# EAGLE schematic SP-PC-V3.0 (EAGLE 8.7.0)

## Sheet 1 of 9: R2
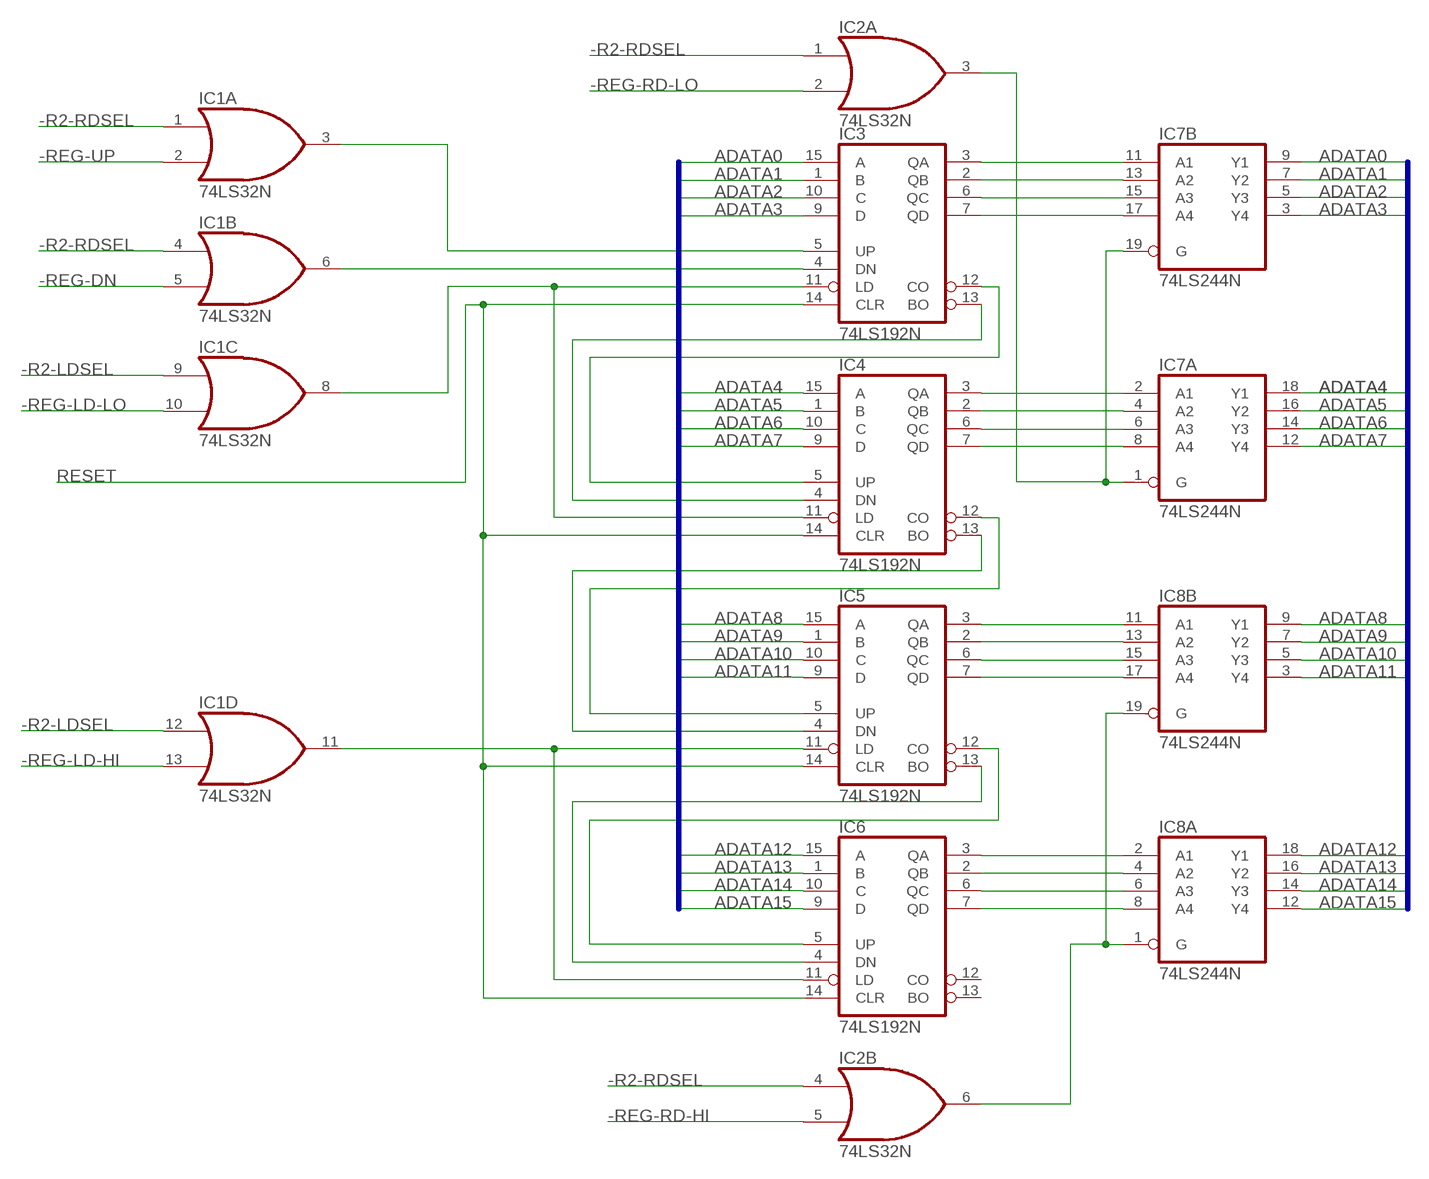
[diagram p0: schematic, sheet 1]

### Parts
IC1  74LS32N  [DIL14]
IC2  74LS32N  [DIL14]
IC3  74LS192N  [DIL16]
IC4  74LS192N  [DIL16]
IC5  74LS192N  [DIL16]
IC6  74LS192N  [DIL16]
IC7  74LS244N  [DIL20]
IC8  74LS244N  [DIL20]

### Nets
-R2-LDSEL: IC1.9(C:I0) IC1.12(D:I0) ; also sheet 7
-R2-RDSEL: IC1.1(A:I0) IC1.4(B:I0) IC2.1(A:I0) IC2.4(B:I0) ; also sheet 7
-REG-DN: IC1.5(B:I1) ; also sheet 2,3,4,9
-REG-LD-HI: IC1.13(D:I1) ; also sheet 2,3,4,9
-REG-LD-LO: IC1.10(C:I1) ; also sheet 2,3,4,9
-REG-RD-HI: IC2.5(B:I1) ; also sheet 2,3,4,9
-REG-RD-LO: IC2.2(A:I1) ; also sheet 2,3,4,9
-REG-UP: IC1.2(A:I1) ; also sheet 2,3,4,9
ADATA0: IC3.15(A) IC7.9(B:Y1) ; also sheet 2,3,4,6,8
ADATA1: IC3.1(B) IC7.7(B:Y2) ; also sheet 2,3,4,6,8
ADATA2: IC3.10(C) IC7.5(B:Y3) ; also sheet 2,3,4,6,8
ADATA3: IC3.9(D) IC7.3(B:Y4) ; also sheet 2,3,4,6,8
ADATA4: IC4.15(A) IC7.18(A:Y1) ; also sheet 2,3,4,6,8
ADATA5: IC4.1(B) IC7.16(A:Y2) ; also sheet 2,3,4,6,8
ADATA6: IC4.10(C) IC7.14(A:Y3) ; also sheet 2,3,4,6,8
ADATA7: IC4.9(D) IC7.12(A:Y4) ; also sheet 2,3,4,6,8
ADATA8: IC5.15(A) IC8.9(B:Y1) ; also sheet 2,3,4,6,8
ADATA9: IC5.1(B) IC8.7(B:Y2) ; also sheet 2,3,4,6,8
ADATA10: IC5.10(C) IC8.5(B:Y3) ; also sheet 2,3,4,6,8
ADATA11: IC5.9(D) IC8.3(B:Y4) ; also sheet 2,3,4,6,8
ADATA12: IC6.15(A) IC8.18(A:Y1) ; also sheet 2,3,4,6,8
ADATA13: IC6.1(B) IC8.16(A:Y2) ; also sheet 2,3,4,6,8
ADATA14: IC6.10(C) IC8.14(A:Y3) ; also sheet 2,3,4,6,8
ADATA15: IC6.9(D) IC8.12(A:Y4) ; also sheet 2,3,4,6,8
N$10: IC3.13(BO) IC4.4(DN)
N$11: IC3.12(CO) IC4.5(UP)
N$12: IC4.13(BO) IC5.4(DN)
N$13: IC4.12(CO) IC5.5(UP)
N$14: IC5.13(BO) IC6.4(DN)
N$15: IC5.12(CO) IC6.5(UP)
N$16: IC1.8(C:O) IC3.11(LD) IC4.11(LD)
N$17: IC1.3(A:O) IC3.5(UP)
N$18: IC1.6(B:O) IC3.4(DN)
N$20: IC2.3(A:O) IC7.1(A:G) IC7.19(B:G)
N$21: IC2.6(B:O) IC8.1(A:G) IC8.19(B:G)
N$22: IC1.11(D:O) IC5.11(LD) IC6.11(LD)
N$115: IC3.3(QA) IC7.11(B:A1)
N$116: IC3.2(QB) IC7.13(B:A2)
N$117: IC3.6(QC) IC7.15(B:A3)
N$118: IC3.7(QD) IC7.17(B:A4)
N$119: IC4.3(QA) IC7.2(A:A1)
N$120: IC4.2(QB) IC7.4(A:A2)
N$121: IC4.6(QC) IC7.6(A:A3)
N$122: IC4.7(QD) IC7.8(A:A4)
N$123: IC5.3(QA) IC8.11(B:A1)
N$124: IC5.2(QB) IC8.13(B:A2)
N$125: IC5.6(QC) IC8.15(B:A3)
N$126: IC5.7(QD) IC8.17(B:A4)
N$127: IC6.3(QA) IC8.2(A:A1)
N$128: IC6.2(QB) IC8.4(A:A2)
N$129: IC6.6(QC) IC8.6(A:A3)
N$130: IC6.7(QD) IC8.8(A:A4)
RESET: IC3.14(CLR) IC4.14(CLR) IC5.14(CLR) IC6.14(CLR) ; also sheet 2,3,4,8
Unconnected: IC6.12(CO) IC6.13(BO)

### Buses
ADATA[0..15]

## Sheet 2 of 9: R0
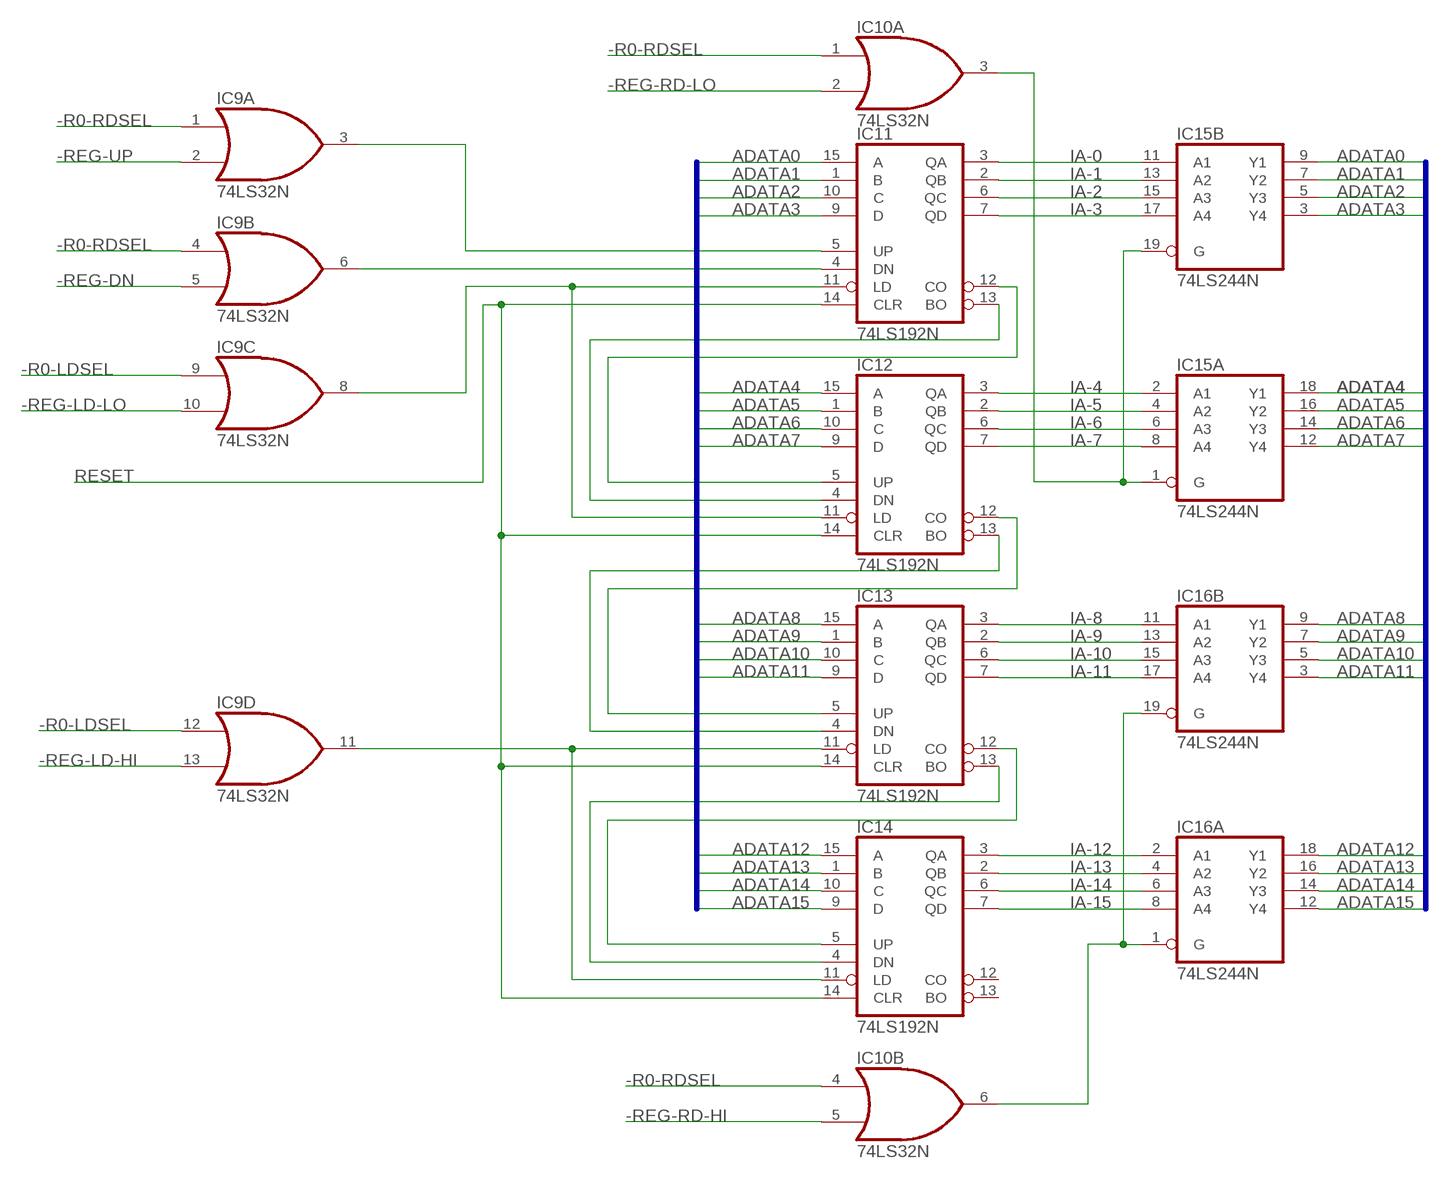
[diagram p1: schematic, sheet 2]

### Parts
IC9  74LS32N  [DIL14]
IC10  74LS32N  [DIL14]
IC11  74LS192N  [DIL16]
IC12  74LS192N  [DIL16]
IC13  74LS192N  [DIL16]
IC14  74LS192N  [DIL16]
IC15  74LS244N  [DIL20]
IC16  74LS244N  [DIL20]

### Nets
-R0-LDSEL: IC9.9(C:I0) IC9.12(D:I0) ; also sheet 7
-R0-RDSEL: IC9.1(A:I0) IC9.4(B:I0) IC10.1(A:I0) IC10.4(B:I0) ; also sheet 7
-REG-DN: IC9.5(B:I1) ; also sheet 1,3,4,9
-REG-LD-HI: IC9.13(D:I1) ; also sheet 1,3,4,9
-REG-LD-LO: IC9.10(C:I1) ; also sheet 1,3,4,9
-REG-RD-HI: IC10.5(B:I1) ; also sheet 1,3,4,9
-REG-RD-LO: IC10.2(A:I1) ; also sheet 1,3,4,9
-REG-UP: IC9.2(A:I1) ; also sheet 1,3,4,9
ADATA0: IC11.15(A) IC15.9(B:Y1) ; also sheet 1,3,4,6,8
ADATA1: IC11.1(B) IC15.7(B:Y2) ; also sheet 1,3,4,6,8
ADATA2: IC11.10(C) IC15.5(B:Y3) ; also sheet 1,3,4,6,8
ADATA3: IC11.9(D) IC15.3(B:Y4) ; also sheet 1,3,4,6,8
ADATA4: IC12.15(A) IC15.18(A:Y1) ; also sheet 1,3,4,6,8
ADATA5: IC12.1(B) IC15.16(A:Y2) ; also sheet 1,3,4,6,8
ADATA6: IC12.10(C) IC15.14(A:Y3) ; also sheet 1,3,4,6,8
ADATA7: IC12.9(D) IC15.12(A:Y4) ; also sheet 1,3,4,6,8
ADATA8: IC13.15(A) IC16.9(B:Y1) ; also sheet 1,3,4,6,8
ADATA9: IC13.1(B) IC16.7(B:Y2) ; also sheet 1,3,4,6,8
ADATA10: IC13.10(C) IC16.5(B:Y3) ; also sheet 1,3,4,6,8
ADATA11: IC13.9(D) IC16.3(B:Y4) ; also sheet 1,3,4,6,8
ADATA12: IC14.15(A) IC16.18(A:Y1) ; also sheet 1,3,4,6,8
ADATA13: IC14.1(B) IC16.16(A:Y2) ; also sheet 1,3,4,6,8
ADATA14: IC14.10(C) IC16.14(A:Y3) ; also sheet 1,3,4,6,8
ADATA15: IC14.9(D) IC16.12(A:Y4) ; also sheet 1,3,4,6,8
IA-0: IC11.3(QA) IC15.11(B:A1) ; also sheet 5
IA-1: IC11.2(QB) IC15.13(B:A2) ; also sheet 5
IA-2: IC11.6(QC) IC15.15(B:A3) ; also sheet 5
IA-3: IC11.7(QD) IC15.17(B:A4) ; also sheet 5
IA-4: IC12.3(QA) IC15.2(A:A1) ; also sheet 5
IA-5: IC12.2(QB) IC15.4(A:A2) ; also sheet 5
IA-6: IC12.6(QC) IC15.6(A:A3) ; also sheet 5
IA-7: IC12.7(QD) IC15.8(A:A4) ; also sheet 5
IA-8: IC13.3(QA) IC16.11(B:A1) ; also sheet 5
IA-9: IC13.2(QB) IC16.13(B:A2) ; also sheet 5
IA-10: IC13.6(QC) IC16.15(B:A3) ; also sheet 5
IA-11: IC13.7(QD) IC16.17(B:A4) ; also sheet 5
IA-12: IC14.3(QA) IC16.2(A:A1) ; also sheet 5
IA-13: IC14.2(QB) IC16.4(A:A2) ; also sheet 5
IA-14: IC14.6(QC) IC16.6(A:A3) ; also sheet 5
IA-15: IC14.7(QD) IC16.8(A:A4) ; also sheet 5
N$28: IC11.13(BO) IC12.4(DN)
N$29: IC11.12(CO) IC12.5(UP)
N$30: IC12.13(BO) IC13.4(DN)
N$31: IC12.12(CO) IC13.5(UP)
N$32: IC13.13(BO) IC14.4(DN)
N$33: IC13.12(CO) IC14.5(UP)
N$34: IC9.8(C:O) IC11.11(LD) IC12.11(LD)
N$35: IC9.3(A:O) IC11.5(UP)
N$36: IC9.6(B:O) IC11.4(DN)
N$38: IC10.3(A:O) IC15.1(A:G) IC15.19(B:G)
N$39: IC10.6(B:O) IC16.1(A:G) IC16.19(B:G)
N$40: IC9.11(D:O) IC13.11(LD) IC14.11(LD)
RESET: IC11.14(CLR) IC12.14(CLR) IC13.14(CLR) IC14.14(CLR) ; also sheet 1,3,4,8
Unconnected: IC14.12(CO) IC14.13(BO)

### Buses
ADATA[0..15]

## Sheet 3 of 9: R3
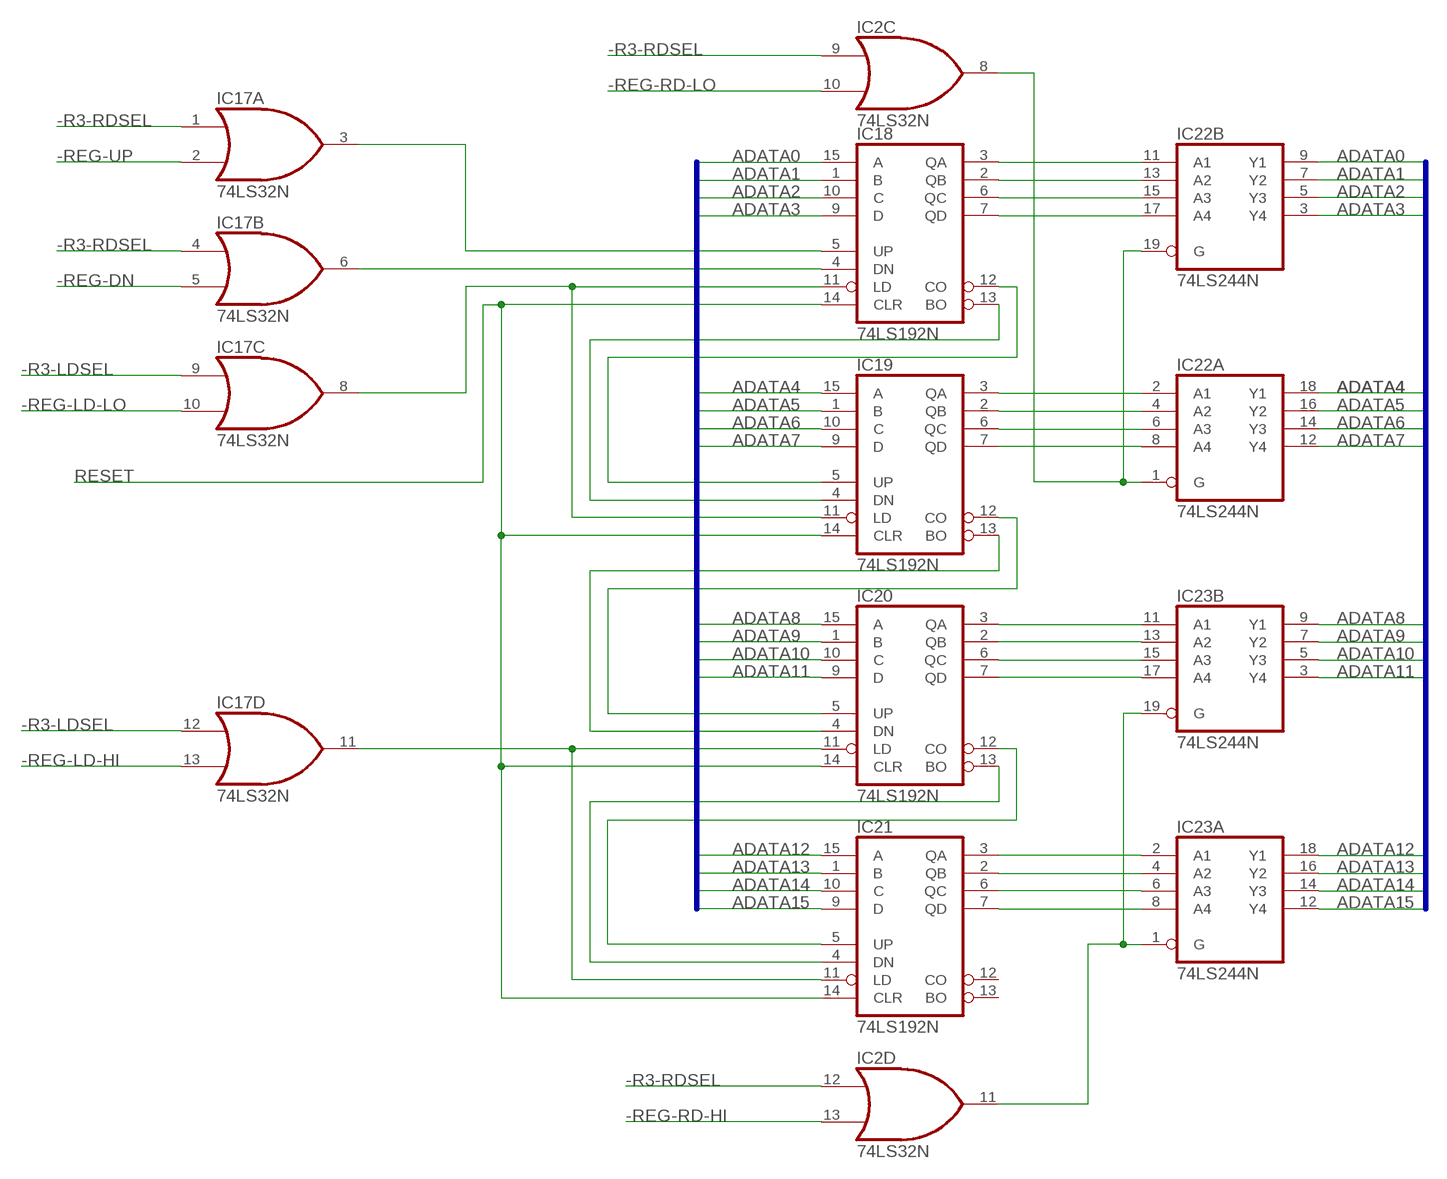
[diagram p2: schematic, sheet 3]

### Parts
IC17  74LS32N  [DIL14]
IC18  74LS192N  [DIL16]
IC19  74LS192N  [DIL16]
IC20  74LS192N  [DIL16]
IC21  74LS192N  [DIL16]
IC22  74LS244N  [DIL20]
IC23  74LS244N  [DIL20]

### Nets
-R3-LDSEL: IC17.9(C:I0) IC17.12(D:I0) ; also sheet 7
-R3-RDSEL: IC2.9(C:I0) IC2.12(D:I0) IC17.1(A:I0) IC17.4(B:I0) ; also sheet 7
-REG-DN: IC17.5(B:I1) ; also sheet 1,2,4,9
-REG-LD-HI: IC17.13(D:I1) ; also sheet 1,2,4,9
-REG-LD-LO: IC17.10(C:I1) ; also sheet 1,2,4,9
-REG-RD-HI: IC2.13(D:I1) ; also sheet 1,2,4,9
-REG-RD-LO: IC2.10(C:I1) ; also sheet 1,2,4,9
-REG-UP: IC17.2(A:I1) ; also sheet 1,2,4,9
ADATA0: IC18.15(A) IC22.9(B:Y1) ; also sheet 1,2,4,6,8
ADATA1: IC18.1(B) IC22.7(B:Y2) ; also sheet 1,2,4,6,8
ADATA2: IC18.10(C) IC22.5(B:Y3) ; also sheet 1,2,4,6,8
ADATA3: IC18.9(D) IC22.3(B:Y4) ; also sheet 1,2,4,6,8
ADATA4: IC19.15(A) IC22.18(A:Y1) ; also sheet 1,2,4,6,8
ADATA5: IC19.1(B) IC22.16(A:Y2) ; also sheet 1,2,4,6,8
ADATA6: IC19.10(C) IC22.14(A:Y3) ; also sheet 1,2,4,6,8
ADATA7: IC19.9(D) IC22.12(A:Y4) ; also sheet 1,2,4,6,8
ADATA8: IC20.15(A) IC23.9(B:Y1) ; also sheet 1,2,4,6,8
ADATA9: IC20.1(B) IC23.7(B:Y2) ; also sheet 1,2,4,6,8
ADATA10: IC20.10(C) IC23.5(B:Y3) ; also sheet 1,2,4,6,8
ADATA11: IC20.9(D) IC23.3(B:Y4) ; also sheet 1,2,4,6,8
ADATA12: IC21.15(A) IC23.18(A:Y1) ; also sheet 1,2,4,6,8
ADATA13: IC21.1(B) IC23.16(A:Y2) ; also sheet 1,2,4,6,8
ADATA14: IC21.10(C) IC23.14(A:Y3) ; also sheet 1,2,4,6,8
ADATA15: IC21.9(D) IC23.12(A:Y4) ; also sheet 1,2,4,6,8
N$58: IC18.13(BO) IC19.4(DN)
N$59: IC18.12(CO) IC19.5(UP)
N$60: IC19.13(BO) IC20.4(DN)
N$61: IC19.12(CO) IC20.5(UP)
N$62: IC20.13(BO) IC21.4(DN)
N$63: IC20.12(CO) IC21.5(UP)
N$64: IC17.8(C:O) IC18.11(LD) IC19.11(LD)
N$65: IC17.3(A:O) IC18.5(UP)
N$66: IC17.6(B:O) IC18.4(DN)
N$80: IC18.3(QA) IC22.11(B:A1)
N$81: IC18.2(QB) IC22.13(B:A2)
N$82: IC18.6(QC) IC22.15(B:A3)
N$83: IC18.7(QD) IC22.17(B:A4)
N$84: IC2.8(C:O) IC22.1(A:G) IC22.19(B:G)
N$85: IC2.11(D:O) IC23.1(A:G) IC23.19(B:G)
N$86: IC17.11(D:O) IC20.11(LD) IC21.11(LD)
N$87: IC19.3(QA) IC22.2(A:A1)
N$88: IC19.2(QB) IC22.4(A:A2)
N$89: IC19.6(QC) IC22.6(A:A3)
N$90: IC19.7(QD) IC22.8(A:A4)
N$91: IC20.3(QA) IC23.11(B:A1)
N$92: IC20.2(QB) IC23.13(B:A2)
N$93: IC20.6(QC) IC23.15(B:A3)
N$94: IC20.7(QD) IC23.17(B:A4)
N$95: IC21.3(QA) IC23.2(A:A1)
N$96: IC21.2(QB) IC23.4(A:A2)
N$97: IC21.6(QC) IC23.6(A:A3)
N$98: IC21.7(QD) IC23.8(A:A4)
RESET: IC18.14(CLR) IC19.14(CLR) IC20.14(CLR) IC21.14(CLR) ; also sheet 1,2,4,8
Unconnected: IC21.12(CO) IC21.13(BO)

### Buses
ADATA[0..15]

## Sheet 4 of 9: R1
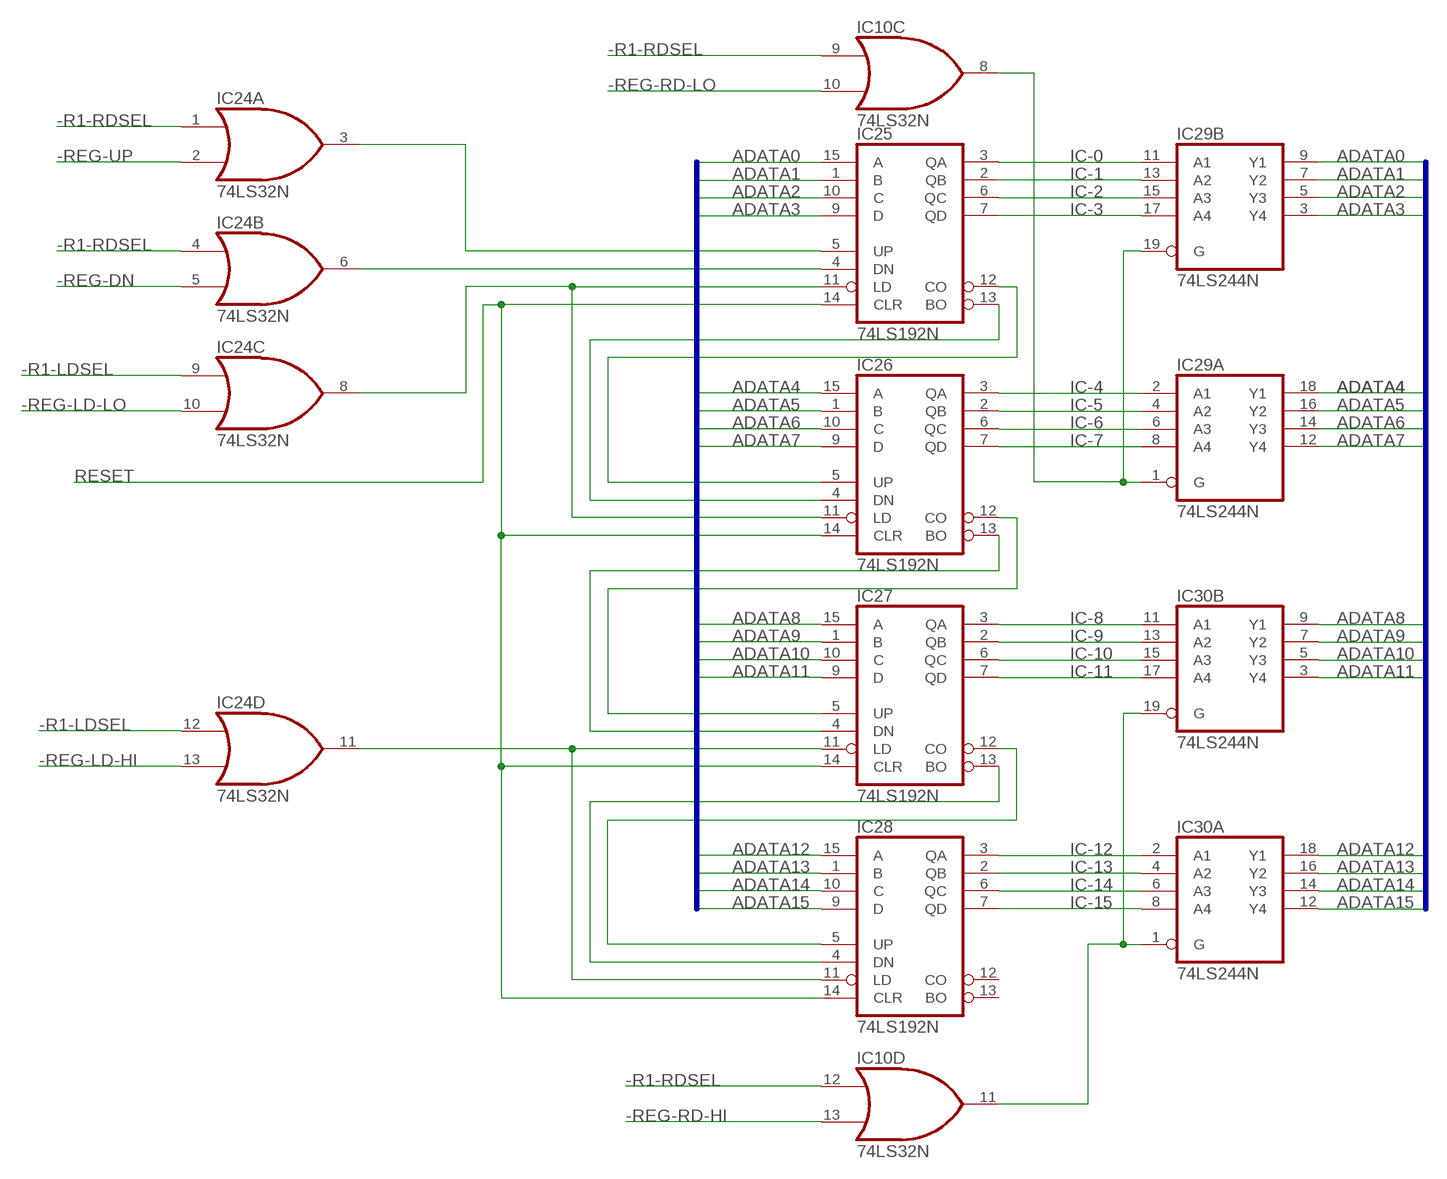
[diagram p3: schematic, sheet 4]

### Parts
IC24  74LS32N  [DIL14]
IC25  74LS192N  [DIL16]
IC26  74LS192N  [DIL16]
IC27  74LS192N  [DIL16]
IC28  74LS192N  [DIL16]
IC29  74LS244N  [DIL20]
IC30  74LS244N  [DIL20]

### Nets
-R1-LDSEL: IC24.9(C:I0) IC24.12(D:I0) ; also sheet 7
-R1-RDSEL: IC10.9(C:I0) IC10.12(D:I0) IC24.1(A:I0) IC24.4(B:I0) ; also sheet 7
-REG-DN: IC24.5(B:I1) ; also sheet 1,2,3,9
-REG-LD-HI: IC24.13(D:I1) ; also sheet 1,2,3,9
-REG-LD-LO: IC24.10(C:I1) ; also sheet 1,2,3,9
-REG-RD-HI: IC10.13(D:I1) ; also sheet 1,2,3,9
-REG-RD-LO: IC10.10(C:I1) ; also sheet 1,2,3,9
-REG-UP: IC24.2(A:I1) ; also sheet 1,2,3,9
ADATA0: IC25.15(A) IC29.9(B:Y1) ; also sheet 1,2,3,6,8
ADATA1: IC25.1(B) IC29.7(B:Y2) ; also sheet 1,2,3,6,8
ADATA2: IC25.10(C) IC29.5(B:Y3) ; also sheet 1,2,3,6,8
ADATA3: IC25.9(D) IC29.3(B:Y4) ; also sheet 1,2,3,6,8
ADATA4: IC26.15(A) IC29.18(A:Y1) ; also sheet 1,2,3,6,8
ADATA5: IC26.1(B) IC29.16(A:Y2) ; also sheet 1,2,3,6,8
ADATA6: IC26.10(C) IC29.14(A:Y3) ; also sheet 1,2,3,6,8
ADATA7: IC26.9(D) IC29.12(A:Y4) ; also sheet 1,2,3,6,8
ADATA8: IC27.15(A) IC30.9(B:Y1) ; also sheet 1,2,3,6,8
ADATA9: IC27.1(B) IC30.7(B:Y2) ; also sheet 1,2,3,6,8
ADATA10: IC27.10(C) IC30.5(B:Y3) ; also sheet 1,2,3,6,8
ADATA11: IC27.9(D) IC30.3(B:Y4) ; also sheet 1,2,3,6,8
ADATA12: IC28.15(A) IC30.18(A:Y1) ; also sheet 1,2,3,6,8
ADATA13: IC28.1(B) IC30.16(A:Y2) ; also sheet 1,2,3,6,8
ADATA14: IC28.10(C) IC30.14(A:Y3) ; also sheet 1,2,3,6,8
ADATA15: IC28.9(D) IC30.12(A:Y4) ; also sheet 1,2,3,6,8
IC-0: IC25.3(QA) IC29.11(B:A1) ; also sheet 5
IC-1: IC25.2(QB) IC29.13(B:A2) ; also sheet 5
IC-2: IC25.6(QC) IC29.15(B:A3) ; also sheet 5
IC-3: IC25.7(QD) IC29.17(B:A4) ; also sheet 5
IC-4: IC26.3(QA) IC29.2(A:A1) ; also sheet 5
IC-5: IC26.2(QB) IC29.4(A:A2) ; also sheet 5
IC-6: IC26.6(QC) IC29.6(A:A3) ; also sheet 5
IC-7: IC26.7(QD) IC29.8(A:A4) ; also sheet 5
IC-8: IC27.3(QA) IC30.11(B:A1) ; also sheet 5
IC-9: IC27.2(QB) IC30.13(B:A2) ; also sheet 5
IC-10: IC27.6(QC) IC30.15(B:A3) ; also sheet 5
IC-11: IC27.7(QD) IC30.17(B:A4) ; also sheet 5
IC-12: IC28.3(QA) IC30.2(A:A1)
IC-13: IC28.2(QB) IC30.4(A:A2) ; also sheet 5
IC-14: IC28.6(QC) IC30.6(A:A3) ; also sheet 5
IC-15: IC28.7(QD) IC30.8(A:A4) ; also sheet 5
N$2: IC25.13(BO) IC26.4(DN)
N$3: IC25.12(CO) IC26.5(UP)
N$4: IC26.13(BO) IC27.4(DN)
N$5: IC26.12(CO) IC27.5(UP)
N$6: IC27.13(BO) IC28.4(DN)
N$7: IC27.12(CO) IC28.5(UP)
N$8: IC24.8(C:O) IC25.11(LD) IC26.11(LD)
N$9: IC24.3(A:O) IC25.5(UP)
N$23: IC24.6(B:O) IC25.4(DN)
N$25: IC10.8(C:O) IC29.1(A:G) IC29.19(B:G)
N$26: IC10.11(D:O) IC30.1(A:G) IC30.19(B:G)
N$27: IC24.11(D:O) IC27.11(LD) IC28.11(LD)
RESET: IC25.14(CLR) IC26.14(CLR) IC27.14(CLR) IC28.14(CLR) ; also sheet 1,2,3,8
Unconnected: IC28.12(CO) IC28.13(BO)

### Buses
ADATA[0..15]

## Sheet 5 of 9: Front Panel
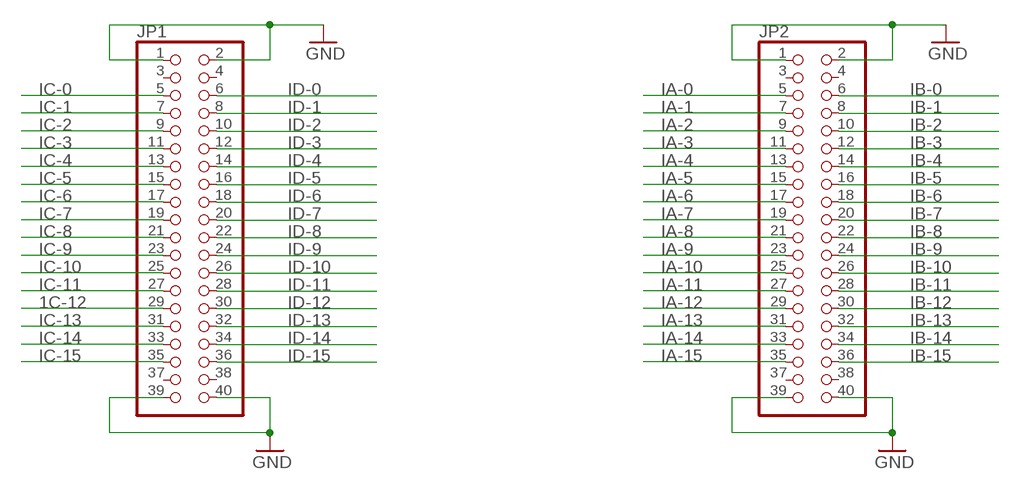
[diagram p4: schematic, sheet 5]

### Parts
JP1  PINHD-2X20  [2X20]
JP2  PINHD-2X20  [2X20]

### Nets
1C-12: JP1.29
GND: JP1.1 JP1.2 JP1.39 JP1.40 JP2.1 JP2.2 JP2.39 JP2.40 ; also sheet 6,8,9
IA-0: JP2.5 ; also sheet 2
IA-1: JP2.7 ; also sheet 2
IA-2: JP2.9 ; also sheet 2
IA-3: JP2.11 ; also sheet 2
IA-4: JP2.13 ; also sheet 2
IA-5: JP2.15 ; also sheet 2
IA-6: JP2.17 ; also sheet 2
IA-7: JP2.19 ; also sheet 2
IA-8: JP2.21 ; also sheet 2
IA-9: JP2.23 ; also sheet 2
IA-10: JP2.25 ; also sheet 2
IA-11: JP2.27 ; also sheet 2
IA-12: JP2.29 ; also sheet 2
IA-13: JP2.31 ; also sheet 2
IA-14: JP2.33 ; also sheet 2
IA-15: JP2.35 ; also sheet 2
IB-0: JP2.6
IB-1: JP2.8
IB-2: JP2.10
IB-3: JP2.12
IB-4: JP2.14
IB-5: JP2.16
IB-6: JP2.18
IB-7: JP2.20
IB-8: JP2.22
IB-9: JP2.24
IB-10: JP2.26
IB-11: JP2.28
IB-12: JP2.30
IB-13: JP2.32
IB-14: JP2.34
IB-15: JP2.36
IC-0: JP1.5 ; also sheet 4
IC-1: JP1.7 ; also sheet 4
IC-2: JP1.9 ; also sheet 4
IC-3: JP1.11 ; also sheet 4
IC-4: JP1.13 ; also sheet 4
IC-5: JP1.15 ; also sheet 4
IC-6: JP1.17 ; also sheet 4
IC-7: JP1.19 ; also sheet 4
IC-8: JP1.21 ; also sheet 4
IC-9: JP1.23 ; also sheet 4
IC-10: JP1.25 ; also sheet 4
IC-11: JP1.27 ; also sheet 4
IC-13: JP1.31 ; also sheet 4
IC-14: JP1.33 ; also sheet 4
IC-15: JP1.35 ; also sheet 4
ID-0: JP1.6
ID-1: JP1.8
ID-2: JP1.10
ID-3: JP1.12
ID-4: JP1.14
ID-5: JP1.16
ID-6: JP1.18
ID-7: JP1.20
ID-8: JP1.22
ID-9: JP1.24
ID-10: JP1.26
ID-11: JP1.28
ID-12: JP1.30
ID-13: JP1.32
ID-14: JP1.34
ID-15: JP1.36
Unconnected: JP1.3 JP1.4 JP1.37 JP1.38 JP2.3 JP2.4 JP2.37 JP2.38

## Sheet 6 of 9: PULLUPS & BYPASS & UNUSED
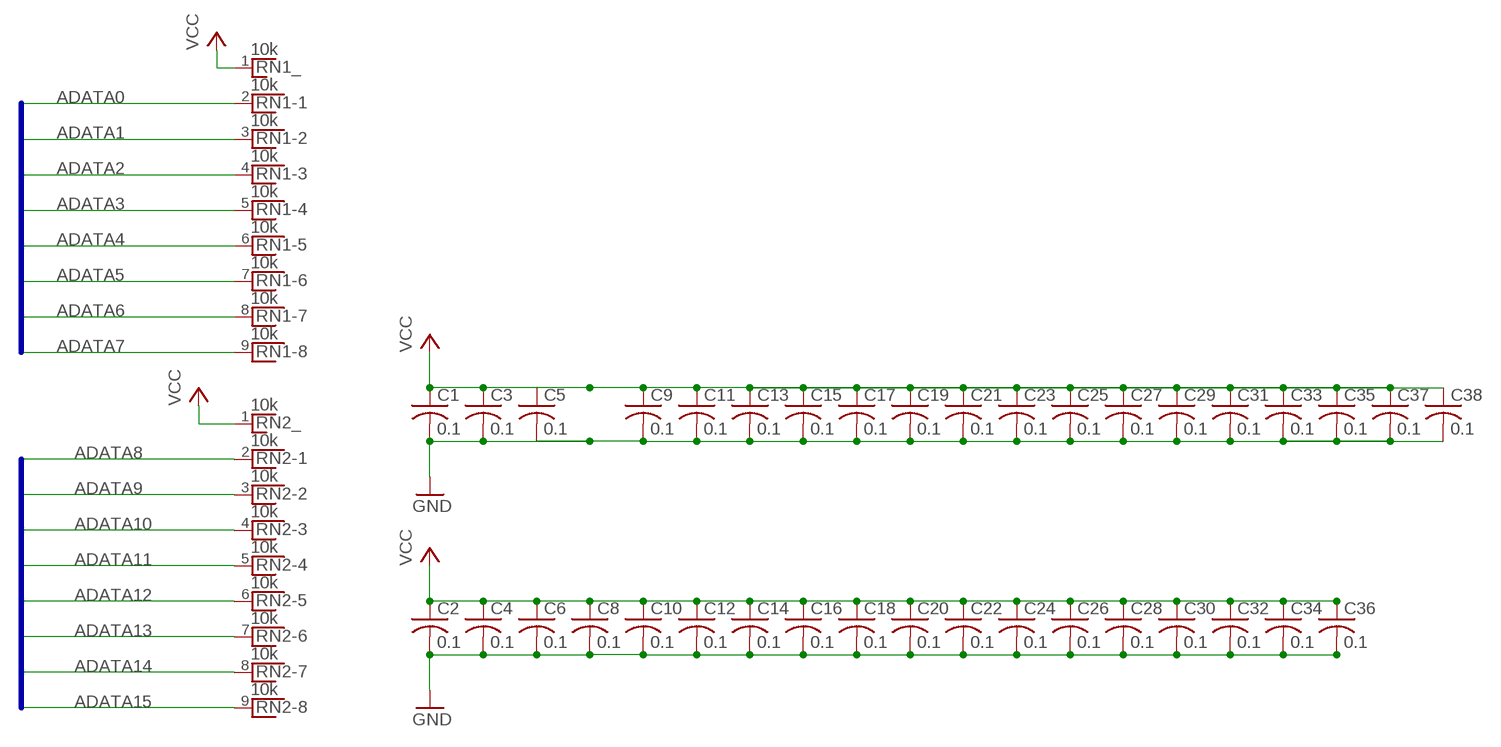
[diagram p5: schematic, sheet 6]

### Parts
C1  0.1  C-US025-040X050  [C025-040X050]
C2  0.1  C-US025-040X050  [C025-040X050]
C3  0.1  C-US025-040X050  [C025-040X050]
C4  0.1  C-US025-040X050  [C025-040X050]
C5  0.1  C-US025-040X050  [C025-040X050]
C6  0.1  C-US025-040X050  [C025-040X050]
C8  0.1  C-US025-040X050  [C025-040X050]
C9  0.1  C-US025-040X050  [C025-040X050]
C10  0.1  C-US025-040X050  [C025-040X050]
C11  0.1  C-US025-040X050  [C025-040X050]
C12  0.1  C-US025-040X050  [C025-040X050]
C13  0.1  C-US025-040X050  [C025-040X050]
C14  0.1  C-US025-040X050  [C025-040X050]
C15  0.1  C-US025-040X050  [C025-040X050]
C16  0.1  C-US025-040X050  [C025-040X050]
C17  0.1  C-US025-040X050  [C025-040X050]
C18  0.1  C-US025-040X050  [C025-040X050]
C19  0.1  C-US025-040X050  [C025-040X050]
C20  0.1  C-US025-040X050  [C025-040X050]
C21  0.1  C-US025-040X050  [C025-040X050]
C22  0.1  C-US025-040X050  [C025-040X050]
C23  0.1  C-US025-040X050  [C025-040X050]
C24  0.1  C-US025-040X050  [C025-040X050]
C25  0.1  C-US025-040X050  [C025-040X050]
C26  0.1  C-US025-040X050  [C025-040X050]
C27  0.1  C-US025-040X050  [C025-040X050]
C28  0.1  C-US025-040X050  [C025-040X050]
C29  0.1  C-US025-040X050  [C025-040X050]
C30  0.1  C-US025-040X050  [C025-040X050]
C31  0.1  C-US025-040X050  [C025-040X050]
C32  0.1  C-US025-040X050  [C025-040X050]
C33  0.1  C-US025-040X050  [C025-040X050]
C34  0.1  C-US025-040X050  [C025-040X050]
C35  0.1  C-US025-040X050  [C025-040X050]
C36  0.1  C-US025-040X050  [C025-040X050]
C37  0.1  C-US025-040X050  [C025-040X050]
C38  0.1  C-US025-040X050  [C025-040X050]
RN1  10k  RNX8  [RN-9]
RN2  10k  RNX8  [RN-9]

### Nets
ADATA0: RN1.2 ; also sheet 1,2,3,4,8
ADATA1: RN1.3 ; also sheet 1,2,3,4,8
ADATA2: RN1.4 ; also sheet 1,2,3,4,8
ADATA3: RN1.5 ; also sheet 1,2,3,4,8
ADATA4: RN1.6 ; also sheet 1,2,3,4,8
ADATA5: RN1.7 ; also sheet 1,2,3,4,8
ADATA6: RN1.8 ; also sheet 1,2,3,4,8
ADATA7: RN1.9 ; also sheet 1,2,3,4,8
ADATA8: RN2.2 ; also sheet 1,2,3,4,8
ADATA9: RN2.3 ; also sheet 1,2,3,4,8
ADATA10: RN2.4 ; also sheet 1,2,3,4,8
ADATA11: RN2.5 ; also sheet 1,2,3,4,8
ADATA12: RN2.6 ; also sheet 1,2,3,4,8
ADATA13: RN2.7 ; also sheet 1,2,3,4,8
ADATA14: RN2.8 ; also sheet 1,2,3,4,8
ADATA15: RN2.9 ; also sheet 1,2,3,4,8
GND: C1.2 C2.2 C3.2 C4.2 C5.2 C6.2 C8.2 C9.2 C10.2 C11.2 C12.2 C13.2 C14.2 C15.2 C16.2 C17.2 C18.2 C19.2 C20.2 C21.2 C22.2 C23.2 C24.2 C25.2 C26.2 C27.2 C28.2 C29.2 C30.2 C31.2 C32.2 C33.2 C34.2 C35.2 C36.2 C37.2 C38.2 ; also sheet 5,8,9
VCC: C1.1 C2.1 C3.1 C4.1 C5.1 C6.1 C8.1 C9.1 C10.1 C11.1 C12.1 C13.1 C14.1 C15.1 C16.1 C17.1 C18.1 C19.1 C20.1 C21.1 C22.1 C23.1 C24.1 C25.1 C26.1 C27.1 C28.1 C29.1 C30.1 C31.1 C32.1 C33.1 C34.1 C35.1 C36.1 C37.1 C38.1 RN1.1 RN2.1 ; also sheet 9

### Buses
ADATA[0..7]
ADATA[8..15]

## Sheet 7 of 9: Select Logic
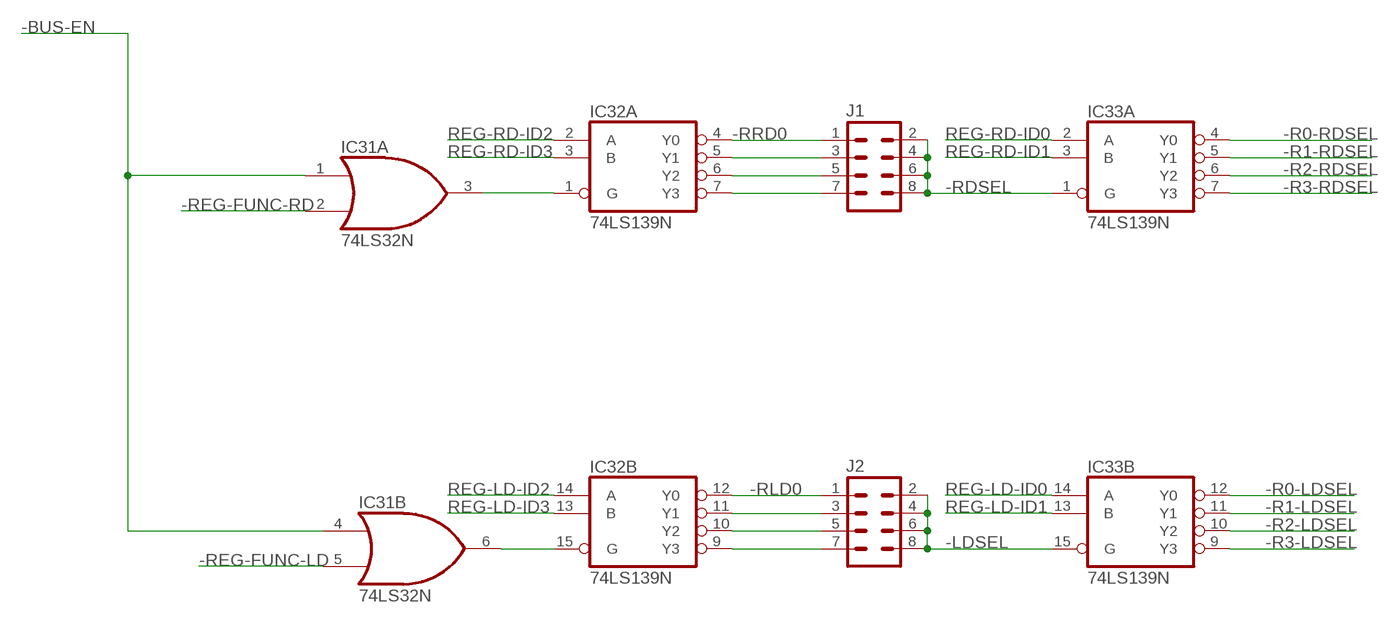
[diagram p6: schematic, sheet 7]

### Parts
IC31  74LS32N  [DIL14]
IC32  74LS139N  [DIL16]
IC33  74LS139N  [DIL16]
J1  M04X2  [2X4]
J2  M04X2  [2X4]

### Nets
-BUS-EN: IC31.1(A:I0) IC31.4(B:I0) ; also sheet 9
-LDSEL: IC33.15(B:G) J2.2 J2.4 J2.6 J2.8 ; also sheet 8
-R0-LDSEL: IC33.12(B:Y0) ; also sheet 2
-R0-RDSEL: IC33.4(A:Y0) ; also sheet 2
-R1-LDSEL: IC33.11(B:Y1) ; also sheet 4
-R1-RDSEL: IC33.5(A:Y1) ; also sheet 4
-R2-LDSEL: IC33.10(B:Y2) ; also sheet 1
-R2-RDSEL: IC33.6(A:Y2) ; also sheet 1
-R3-LDSEL: IC33.9(B:Y3) ; also sheet 3
-R3-RDSEL: IC33.7(A:Y3) ; also sheet 3
-RDSEL: IC33.1(A:G) J1.2 J1.4 J1.6 J1.8 ; also sheet 8
-REG-FUNC-LD: IC31.5(B:I1) ; also sheet 9
-REG-FUNC-RD: IC31.2(A:I1) ; also sheet 9
-RLD0: IC32.12(B:Y0) J2.1
-RRD0: IC32.4(A:Y0) J1.1
N$19: IC31.3(A:O) IC32.1(A:G)
N$24: IC31.6(B:O) IC32.15(B:G)
N$43: IC32.5(A:Y1) J1.3
N$46: IC32.6(A:Y2) J1.5
N$47: IC32.7(A:Y3) J1.7
N$48: IC32.11(B:Y1) J2.3
N$49: IC32.10(B:Y2) J2.5
N$50: IC32.9(B:Y3) J2.7
REG-LD-ID0: IC33.14(B:A) ; also sheet 9
REG-LD-ID1: IC33.13(B:B) ; also sheet 9
REG-LD-ID2: IC32.14(B:A) ; also sheet 9
REG-LD-ID3: IC32.13(B:B) ; also sheet 9
REG-RD-ID0: IC33.2(A:A) ; also sheet 9
REG-RD-ID1: IC33.3(A:B) ; also sheet 9
REG-RD-ID2: IC32.2(A:A) ; also sheet 9
REG-RD-ID3: IC32.3(A:B) ; also sheet 9

## Sheet 8 of 9: bus buffering
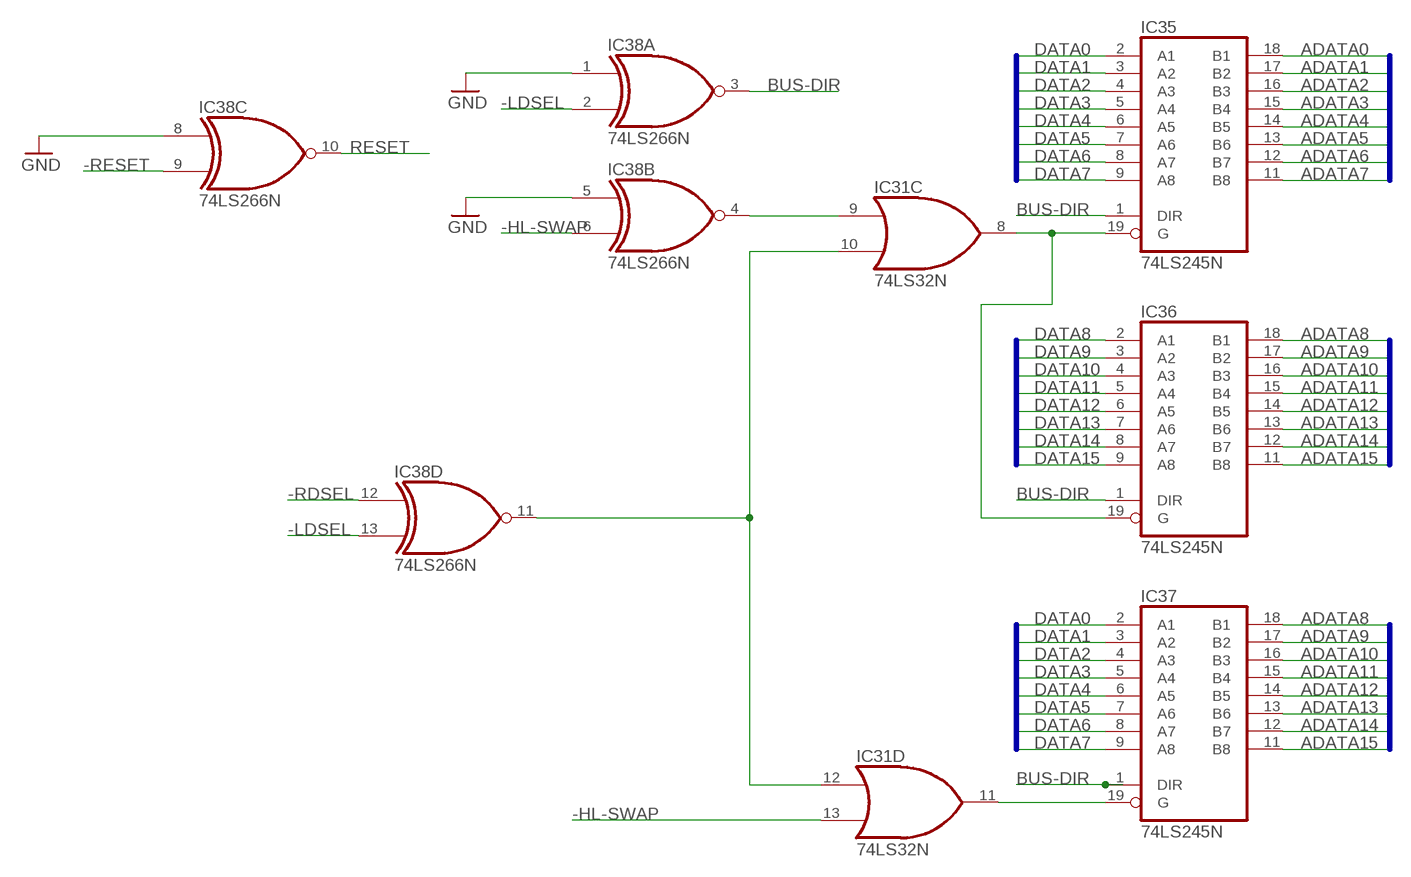
[diagram p7: schematic, sheet 8]

### Parts
IC35  74LS245N  [DIL20]
IC36  74LS245N  [DIL20]
IC37  74LS245N  [DIL20]
IC38  74LS266N  [DIL14]

### Nets
-HL-SWAP: IC31.13(D:I1) IC38.6(B:I1) ; also sheet 9
-LDSEL: IC38.2(A:I1) IC38.13(D:I1) ; also sheet 7
-RDSEL: IC38.12(D:I0) ; also sheet 7
-RESET: IC38.9(C:I1) ; also sheet 9
ADATA0: IC35.18(B1) ; also sheet 1,2,3,4,6
ADATA1: IC35.17(B2) ; also sheet 1,2,3,4,6
ADATA2: IC35.16(B3) ; also sheet 1,2,3,4,6
ADATA3: IC35.15(B4) ; also sheet 1,2,3,4,6
ADATA4: IC35.14(B5) ; also sheet 1,2,3,4,6
ADATA5: IC35.13(B6) ; also sheet 1,2,3,4,6
ADATA6: IC35.12(B7) ; also sheet 1,2,3,4,6
ADATA7: IC35.11(B8) ; also sheet 1,2,3,4,6
ADATA8: IC36.18(B1) IC37.18(B1) ; also sheet 1,2,3,4,6
ADATA9: IC36.17(B2) IC37.17(B2) ; also sheet 1,2,3,4,6
ADATA10: IC36.16(B3) IC37.16(B3) ; also sheet 1,2,3,4,6
ADATA11: IC36.15(B4) IC37.15(B4) ; also sheet 1,2,3,4,6
ADATA12: IC36.14(B5) IC37.14(B5) ; also sheet 1,2,3,4,6
ADATA13: IC36.13(B6) IC37.13(B6) ; also sheet 1,2,3,4,6
ADATA14: IC36.12(B7) IC37.12(B7) ; also sheet 1,2,3,4,6
ADATA15: IC36.11(B8) IC37.11(B8) ; also sheet 1,2,3,4,6
BUS-DIR: IC35.1(DIR) IC36.1(DIR) IC37.1(DIR) IC38.3(A:O)
DATA0: IC35.2(A1) IC37.2(A1) ; also sheet 9
DATA1: IC35.3(A2) IC37.3(A2) ; also sheet 9
DATA2: IC35.4(A3) IC37.4(A3) ; also sheet 9
DATA3: IC35.5(A4) IC37.5(A4) ; also sheet 9
DATA4: IC35.6(A5) IC37.6(A5) ; also sheet 9
DATA5: IC35.7(A6) IC37.7(A6) ; also sheet 9
DATA6: IC35.8(A7) IC37.8(A7) ; also sheet 9
DATA7: IC35.9(A8) IC37.9(A8) ; also sheet 9
DATA8: IC36.2(A1) ; also sheet 9
DATA9: IC36.3(A2) ; also sheet 9
DATA10: IC36.4(A3) ; also sheet 9
DATA11: IC36.5(A4) ; also sheet 9
DATA12: IC36.6(A5) ; also sheet 9
DATA13: IC36.7(A6) ; also sheet 9
DATA14: IC36.8(A7) ; also sheet 9
DATA15: IC36.9(A8) ; also sheet 9
GND: IC38.1(A:I0) IC38.5(B:I0) IC38.8(C:I0) ; also sheet 5,6,9
N$1: IC31.8(C:O) IC35.19(G) IC36.19(G)
N$37: IC31.11(D:O) IC37.19(G)
N$41: IC31.9(C:I0) IC38.4(B:O)
N$42: IC31.10(C:I1) IC31.12(D:I0) IC38.11(D:O)
RESET: IC38.10(C:O) ; also sheet 1,2,3,4

### Buses
DATA[8..15]
DATA[0..7]
ADATA[0..7]
ADATA[8..15]

## Sheet 9 of 9: BUS
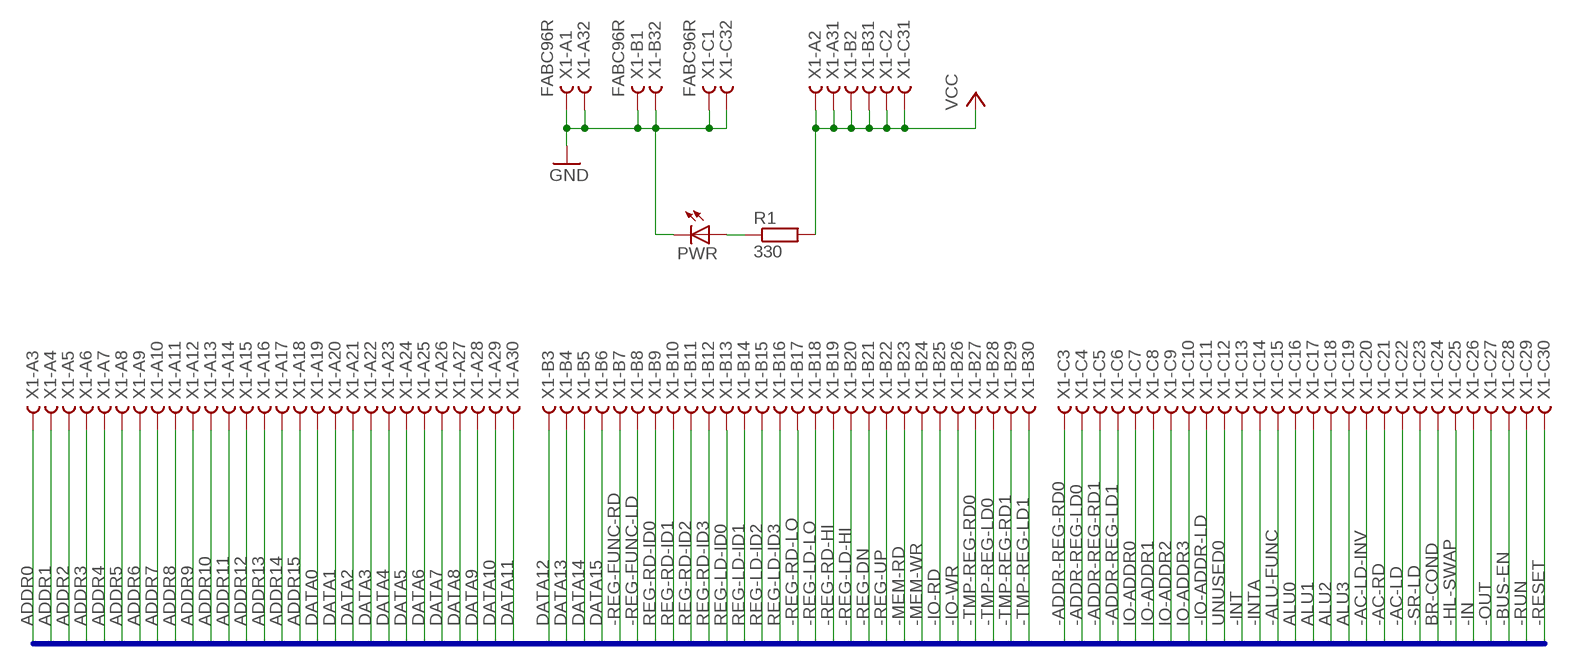
[diagram p8: schematic, sheet 9]

### Parts
PWR  LED5MM  [LED5MM]
R1  330  R0207/10  [0207/10]
X1  FABC96R  [FABC96R]

### Nets
-AC-LD: X1.C22
-AC-LD-INV: X1.C20
-AC-RD: X1.C21
-ADDR-REG-LD0: X1.C4
-ADDR-REG-LD1: X1.C6
-ADDR-REG-RD0: X1.C3
-ADDR-REG-RD1: X1.C5
-ALU-FUNC: X1.C15
-BUS-EN: X1.C28 ; also sheet 7
-HL-SWAP: X1.C25 ; also sheet 8
-IN: X1.C26
-INT: X1.C13
-INTA: X1.C14
-IO-ADDR-LD: X1.C11
-IO-RD: X1.B25
-IO-WR: X1.B26
-MEM-RD: X1.B23
-MEM-WR: X1.B24
-OUT: X1.C27
-REG-DN: X1.B21 ; also sheet 1,2,3,4
-REG-FUNC-LD: X1.B8 ; also sheet 7
-REG-FUNC-RD: X1.B7 ; also sheet 7
-REG-LD-HI: X1.B20 ; also sheet 1,2,3,4
-REG-LD-LO: X1.B18 ; also sheet 1,2,3,4
-REG-RD-HI: X1.B19 ; also sheet 1,2,3,4
-REG-RD-LO: X1.B17 ; also sheet 1,2,3,4
-REG-UP: X1.B22 ; also sheet 1,2,3,4
-RESET: X1.C30 ; also sheet 8
-RUN: X1.C29
-SR-LD: X1.C23
-TMP-REG-LD0: X1.B28
-TMP-REG-LD1: X1.B30
-TMP-REG-RD0: X1.B27
-TMP-REG-RD1: X1.B29
ADDR0: X1.A3
ADDR1: X1.A4
ADDR2: X1.A5
ADDR3: X1.A6
ADDR4: X1.A7
ADDR5: X1.A8
ADDR6: X1.A9
ADDR7: X1.A10
ADDR8: X1.A11
ADDR9: X1.A12
ADDR10: X1.A13
ADDR11: X1.A14
ADDR12: X1.A15
ADDR13: X1.A16
ADDR14: X1.A17
ADDR15: X1.A18
ALU0: X1.C16
ALU1: X1.C17
ALU2: X1.C18
ALU3: X1.C19
BR-COND: X1.C24
DATA0: X1.A19 ; also sheet 8
DATA1: X1.A20 ; also sheet 8
DATA2: X1.A21 ; also sheet 8
DATA3: X1.A22 ; also sheet 8
DATA4: X1.A23 ; also sheet 8
DATA5: X1.A24 ; also sheet 8
DATA6: X1.A25 ; also sheet 8
DATA7: X1.A26 ; also sheet 8
DATA8: X1.A27 ; also sheet 8
DATA9: X1.A28 ; also sheet 8
DATA10: X1.A29 ; also sheet 8
DATA11: X1.A30 ; also sheet 8
DATA12: X1.B3 ; also sheet 8
DATA13: X1.B4 ; also sheet 8
DATA14: X1.B5 ; also sheet 8
DATA15: X1.B6 ; also sheet 8
GND: PWR.K(C) X1.A1 X1.A32 X1.B1 X1.B32 X1.C1 X1.C32 ; also sheet 5,6,8
IO-ADDR0: X1.C7
IO-ADDR1: X1.C8
IO-ADDR2: X1.C9
IO-ADDR3: X1.C10
N$44: PWR.A R1.1
REG-LD-ID0: X1.B13 ; also sheet 7
REG-LD-ID1: X1.B14 ; also sheet 7
REG-LD-ID2: X1.B15 ; also sheet 7
REG-LD-ID3: X1.B16 ; also sheet 7
REG-RD-ID0: X1.B9 ; also sheet 7
REG-RD-ID1: X1.B10 ; also sheet 7
REG-RD-ID2: X1.B11 ; also sheet 7
REG-RD-ID3: X1.B12 ; also sheet 7
UNUSED0: X1.C12
VCC: R1.2 X1.A2 X1.A31 X1.B2 X1.B31 X1.C2 X1.C31 ; also sheet 6

### Buses
ADDR[0..15],DATA[0..15],-REG-FUNC-RD,-REG-FUNC-LD,REG-RD-ID[0..3],REG-LD-ID[0..3],-REG-RD-LO,-REG-LD-LO,-REG-RD-HI,-REG-LD-HI,-REG-DN,-REG-UP,-MEM-RD,-MEM-WR,-IO-RD,-IO-WR,-TMP-REG-RD[0..1],-TMP-REG-LD[0..1],-ADDR-REG-RD[0..1],-ADDR-REG-LD[0..1],IO-ADDR[0..3],-IO-ADDR-LD,UNUSED0,-INT,-INTA,-ALU-FUNC,ALU[0..3],-AC-LD-INV,-AC-LD,-AC-RD,-SR-LD,BR-COND,-HL-SWAP,-IN,-OUT,-BUS-EN,-RESET,-RUN

## Power pins joined to a net without a drawn wire
GND: IC1.7(P:GND) IC2.7(P:GND) IC3.8(GND) IC4.8(GND) IC5.8(GND) IC6.8(GND) IC7.10(P:GND) IC8.10(P:GND) IC9.7(P:GND) IC10.7(P:GND) IC11.8(GND) IC12.8(GND) IC13.8(GND) IC14.8(GND) IC15.10(P:GND) IC16.10(P:GND) IC17.7(P:GND) IC18.8(GND) IC19.8(GND) IC20.8(GND) IC21.8(GND) IC22.10(P:GND) IC23.10(P:GND) IC24.7(P:GND) IC25.8(GND) IC26.8(GND) IC27.8(GND) IC28.8(GND) IC29.10(P:GND) IC30.10(P:GND) IC31.7(P:GND) IC32.8(P:GND) IC33.8(P:GND) IC35.10(GND) IC36.10(GND) IC37.10(GND) IC38.7(P:GND)
VCC: IC1.14(P:VCC) IC2.14(P:VCC) IC3.16(VCC) IC4.16(VCC) IC5.16(VCC) IC6.16(VCC) IC7.20(P:VCC) IC8.20(P:VCC) IC9.14(P:VCC) IC10.14(P:VCC) IC11.16(VCC) IC12.16(VCC) IC13.16(VCC) IC14.16(VCC) IC15.20(P:VCC) IC16.20(P:VCC) IC17.14(P:VCC) IC18.16(VCC) IC19.16(VCC) IC20.16(VCC) IC21.16(VCC) IC22.20(P:VCC) IC23.20(P:VCC) IC24.14(P:VCC) IC25.16(VCC) IC26.16(VCC) IC27.16(VCC) IC28.16(VCC) IC29.20(P:VCC) IC30.20(P:VCC) IC31.14(P:VCC) IC32.16(P:VCC) IC33.16(P:VCC) IC35.20(VCC) IC36.20(VCC) IC37.20(VCC) IC38.14(P:VCC)

## Library data of the parts
C1-C6 C8-C38 = resistor:C-US: CAPACITOR, American symbol
IC1 IC2 IC9 IC10 IC17 IC24 IC31 = 74xx-us:74*32: Quad 2-input OR gate
IC3-IC6 IC11-IC14 IC18-IC21 IC25-IC28 = 74xx-us:74*192: Synchronous 4-bit UP/DOWN COUNTER
IC7 IC8 IC15 IC16 IC22 IC23 IC29 IC30 = 74xx-us:74*244: Octal BUFFER and LINE DRIVER, 3-state
IC32 IC33 = 74xx-us:74*139: Dual 2-line to 4-line DECODER/DEMULTIPLEXER
IC35-IC37 = 74xx-us:74*245: Octal BUS TRANSCEIVER, 3-state
IC38 = 74xx-us:74*266: Quadruple EXCLUSIVE-NOR (XNOR), open-collector
J1 J2 = SparkFun-Connectors:M04X2: .1" header, two rows of four.
JP1 JP2 = pinhead:PINHD-2X20: PIN HEADER
PWR = led:LED: LED OSRAM: - CHIPLED LG R971, LG N971, LY N971, LG Q971, LY Q971, LO R971, LY R971 LH N974, LH R974 LS Q976, LO Q976, LY Q976 LO Q996 - Hyper CHIPLED LW Q18S LB Q993, LB Q99A, LB R99A - SideLED LS A670, LO A670, LY A670, LG A670, LP A670 LB A673, LV A673, LT A673, LW A673 LH A674 LY A675 LS A676, LA A676, LO A676, LY A676, LW A676 LS A679, LY A679, LG A679 - Hyper Micro SIDELED® LS Y876, LA Y876, LO Y876, LY Y876 LT Y87S - SmartLED LW L88C, LW L88S LB L89C, LB L89S, LG L890 LS L89K, LO L89K, LY L89K LS L896, LA L896, LO L896, LY L896 - TOPLED LS T670, LO T670, LY T670, LG T670, LP T670 LSG T670, LSP T670, LSY T670, LOP T670, LYG T670 LG T671, LOG T671, LSG T671 LB T673, LV T673, LT T673, LW T673 LH T674 LS T676, LA T676, LO T676, LY T676, LB T676, LH T676, LSB T676, LW T676 LB T67C, LV T67C, LT T67C, LS T67K, LO T67K, LY T67K, LW E67C LS E67B, LA E67B, LO E67B, LY E67B, LB E67C, LV E67C, LT E67C LW T67C LS T679, LY T679, LG T679 LS T770, LO T770, LY T770, LG T770, LP T770 LB T773, LV T773, LT T773, LW T773 LH T774 LS E675, LA E675, LY E675, LS T675 LS T776, LA T776, LO T776, LY T776, LB T776 LHGB T686 LT T68C, LB T68C - Hyper Mini TOPLED® LB M676 - Mini TOPLED Santana® LG M470 LS M47K, LO M47K, LY M47K Source: http://www.osram.convergy.de LUXEON: - LUMILED® LXK2-PW12-R00, LXK2-PW12-S00, LXK2-PW14-U00, LXK2-PW14-V00 LXK2-PM12-R00, LXK2-PM12-S00, LXK2-PM14-U00 LXK2-PE12-Q00, LXK2-PE12-R00, LXK2-PE12-S00, LXK2-PE14-T00, LXK2-PE14-U00 LXK2-PB12-K00, LXK2-PB12-L00, LXK2-PB12-M00, LXK2-PB14-N00, LXK2-PB14-P00, LXK2-PB14-Q00 LXK2-PR12-L00, LXK2-PR12-M00, LXK2-PR14-Q00, LXK2-PR14-R00 LXK2-PD12-Q00, LXK2-PD12-R00, LXK2-PD12-S00 LXK2-PH12-R00, LXK2-PH12-S00 LXK2-PL12-P00, LXK2-PL12-Q00, LXK2-PL12-R00 Source: www.luxeon.com KINGBRIGHT: KA-3528ASYC Source: www.kingbright.com
R1 = eagle-ltspice:R: RESISTOR, European symbol; SPICEMODEL: NONE; SPICEPREFIX: R
RN1 RN2 = resistor-net:RNX8: RESISTOR NETWORK; OC_FARNELL: unknown; OC_NEWARK: unknown
X1 = con-vg:FABC96R: CONNECTOR female, 96 pins, type R, rows ABC, grid 2.54 mm